# EAGLE design ms5839_with_trub (EAGLE 9.6.2)
COMPONENTS: MS5839 & Trübungsmessung; DESCRIPTION: Sensormodul; DRAWING_VERSION: 1.0; DRAWN: Tobias Poppe; FIRMA: Tobias Poppe; PRINTDATE: 30.01.2023; PROJECT: Open-WaLeS; STATUS: Prod.
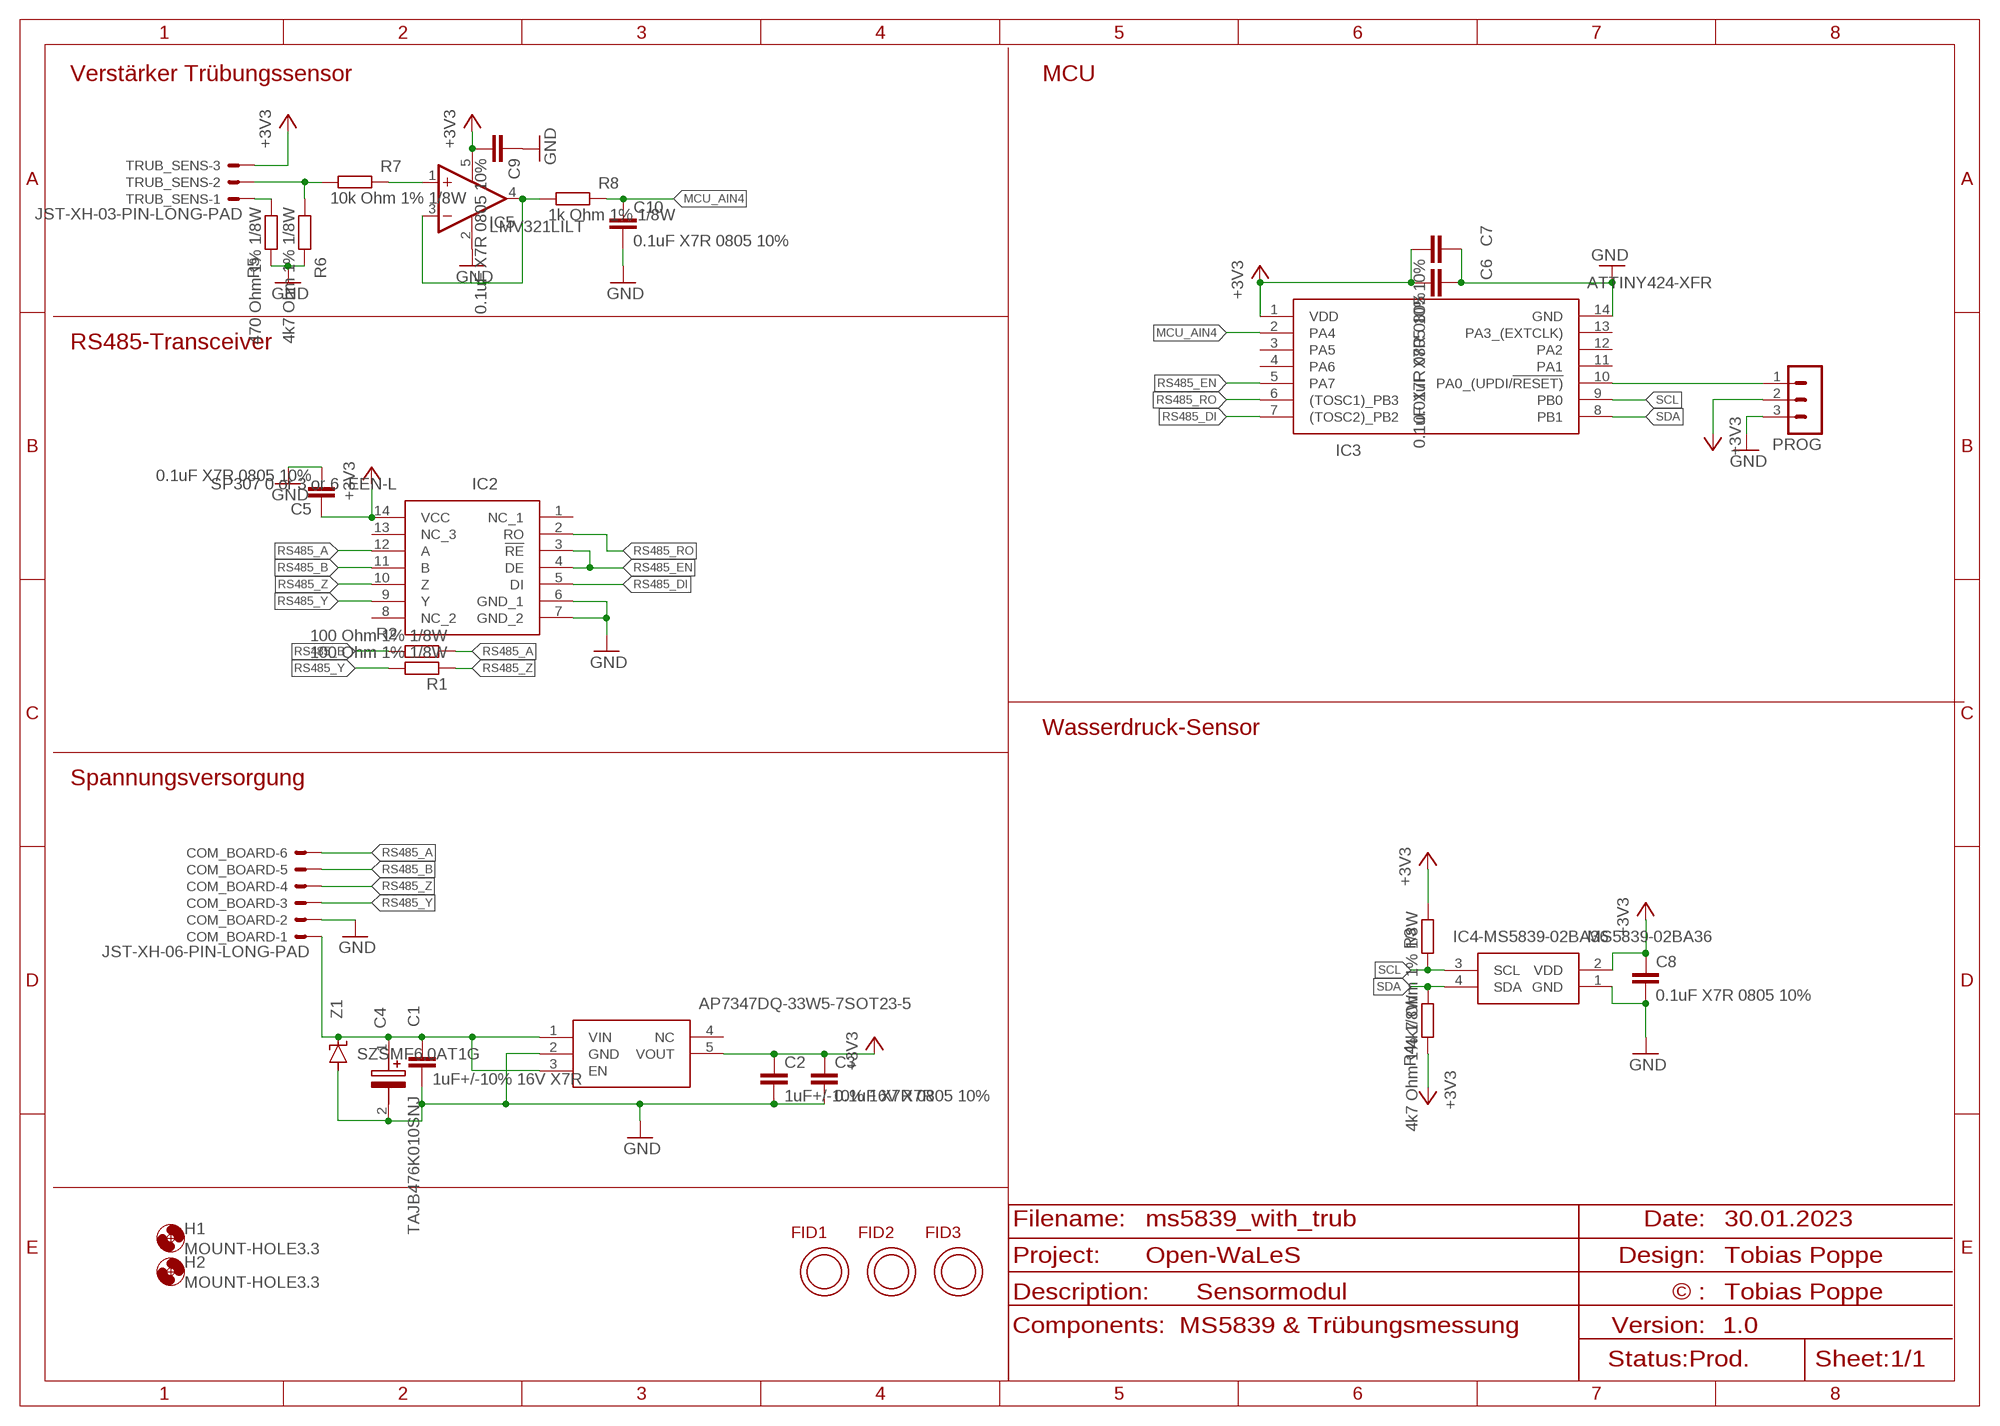
[diagram p0: schematic, sheet 1]

## Parts
C1  1uF+/-10% 16V X7R  C-EUC0805  [C0805]
C2  1uF+/-10% 16V X7R  C-EUC0805  [C0805]
C3  0.1uF X7R 0805 10%  C-EUC0805  [C0805]
C4  TAJB476K010SNJ  [CAPPM3528X210N]
C5  0.1uF X7R 0805 10%  C-EUC0805  [C0805]
C6  0.1uF X7R 0805 10%  C-EUC0805  [C0805]
C7  0.01uF X7R 0805 10%  C-EUC0805  [C0805]
C8  0.1uF X7R 0805 10%  C-EUC0805  [C0805]
C9  0.1uF X7R 0805 10%  C-EUC0805  [C0805]
C10  0.1uF X7R 0805 10%  C-EUC0805  [C0805]
COM_BOARD  JST-XH-06-PIN-LONG-PAD  [JST-XH-06-PACKAGE-LONG-PAD]
FID1  OPEN-PNP-FIDUCIAL  [OPEN-PNP-FIDUCIAL]
FID2  OPEN-PNP-FIDUCIAL  [OPEN-PNP-FIDUCIAL]
FID3  OPEN-PNP-FIDUCIAL  [OPEN-PNP-FIDUCIAL]
H1  MOUNT-HOLE3.3  [3,3]
H2  MOUNT-HOLE3.3  [3,3]
IC1  AP7347DQ-33W5-7SOT23-5  [SOT95P240X110-5N]
IC2  SP307 0 or 3 or 6 EEN-L  SP3076EEN-L  [SOIC127P600X175-14N]
IC3  ATTINY424-XFR  [SOP65P640X120-14N]
IC4-MS5839-02BA36  MS5839-02BA36  [MS583902BA36]
IC5  LMV321LILT  LMV321M5X  [SOT23-5]
PROG  MA03-1  [MA03-1]
R1  100 Ohm 1% 1/8W  R-EU_R0805  [R0805]
R2  100 Ohm 1% 1/8W  R-EU_R0805  [R0805]
R3  4k7 Ohm 1% 1/8W  R-EU_R0805  [R0805]
R4  4k7 Ohm 1% 1/8W  R-EU_R0805  [R0805]
R5  470 Ohm 1% 1/8W  R-EU_R0805  [R0805]
R6  4k7 Ohm 1% 1/8W  R-EU_R0805  [R0805]
R7  10k Ohm 1% 1/8W  R-EU_R0805  [R0805]
R8  1k Ohm 1% 1/8W  R-EU_R0805  [R0805]
TRUB_SENS  JST-XH-03-PIN-LONG-PAD  [JST-XH-03-PACKAGE-LONG-PAD]
Z1  SZSMF6.0AT1G  SZSMF_XX  [SOD123]

## Nets
+3V3: C2.1 C3.1 C5.1 C6.2 C7.2 C8.1 C9.2 IC1.5(VOUT) IC2.14(VCC) IC3.1(VDD) IC4-MS5839-02BA36.2(VDD) IC5.5(V+) PROG.2 R3.1 R4.2 TRUB_SENS.3
GND: C1.2 C2.2 C3.2 C4.2(-) C5.2 C6.1 C7.1 C8.2 C9.1 C10.2 COM_BOARD.2 IC1.2(GND) IC2.6(GND_1) IC2.7(GND_2) IC3.14(GND) IC4-MS5839-02BA36.1(GND) IC5.2(V-) PROG.3 R5.2 R6.2 Z1.A
MCU_AIN4: C10.1 IC3.2(PA4) R8.2
N$1: C1.1 C4.1(+) COM_BOARD.1 IC1.1(VIN) IC1.3(EN) Z1.C
N$2: IC3.10(PA0_(UPDI/!RESET)) PROG.1
N$3: R5.1 TRUB_SENS.1
N$4: R6.1 R7.1 TRUB_SENS.2
N$5: IC5.1(+IN) R7.2
N$6: IC5.3(-IN) IC5.4(OUT) R8.1
RS485_A: COM_BOARD.6 IC2.12(A) R2.1
RS485_B: COM_BOARD.5 IC2.11(B) R2.2
RS485_DI: IC2.5(DI) IC3.7((TOSC2)_PB2)
RS485_EN: IC2.3(!RE) IC2.4(DE) IC3.5(PA7)
RS485_RO: IC2.2(RO) IC3.6((TOSC1)_PB3)
RS485_Y: COM_BOARD.3 IC2.9(Y) R1.2
RS485_Z: COM_BOARD.4 IC2.10(Z) R1.1
SCL: IC3.9(PB0) IC4-MS5839-02BA36.3(SCL) R3.2
SDA: IC3.8(PB1) IC4-MS5839-02BA36.4(SDA) R4.1
Unconnected: IC1.4(NC) IC2.1(NC_1) IC2.8(NC_2) IC2.13(NC_3) IC3.3(PA5) IC3.4(PA6) IC3.11(PA1) IC3.12(PA2) IC3.13(PA3_(EXTCLK))

## Notes on the sheet
- Verstärker Trübungssensor | MCU
- RS485-Transceiver
- Wasserdruck-Sensor
- Spannungsversorgung

## Library data of the parts
C1-C3 C5-C10 = rcl:C-EU: CAPACITOR, European symbol; SPICEPREFIX: C
C4 = samacsys:TAJB476K010SNJ: Tantalum Capacitors - Solid SMD 10volts 47uF 10% Source: Datasheet <http://datasheets.avx.com/TAJ.pdf>; ARROW_PART_NUMBER: TAJB476K010SNJ; ARROW_PRICE-STOCK: https://www.arrow.com/en/products/tajb476k010snj/avx; DESCRIPTION: Tantalum Capacitors - Solid SMD 10volts 47uF 10%; HEIGHT: 2.1mm; MANUFACTURER_NAME: AVX; MANUFACTURER_PART_NUMBER: TAJB476K010SNJ; MOUSER_PART_NUMBER: 581-TAJB476K010SNJ; MOUSER_PRICE-STOCK: https://www.mouser.co.uk/ProductDetail/AVX/TAJB476K010SNJ?qs=ZkOCJBwOl244F5j46leeNA%3D%3D
COM_BOARD = Rembrandt Electronics - JST XH Connectors v1-0:JST-XH-06-PIN: JST XH Connector 2 Pin Wire to board connector. Pitch: 2,54 mm, (0.100") Number of pins: 6 Created by Rembrandt Electronics www.rembrandtelectronics.com
FID1-FID3 = topo-eng:OPEN-PNP-FIDUCIAL
H1 H2 = holes:MOUNT-HOLE: MOUNTING HOLE with drill center marker
IC1 = samacsys:AP7347DQ-33W5-7: LDO Voltage Regulators LDO CMOS LowCurr SOT25 T&R 3K Source: Datasheet <https://ad.componentsearchengine.com/partRequest.html?fs=0&partNumber=AP7347DQ-33W5-7&partID=15420390&lang=null&packageCategoryID=54&C=1&W=1>
IC2 = samacsys:SP3076EEN-L: RS-422/RS-485 Interface IC RS485/RS422 Driver/ Receiver Transceiver Source: Datasheet <https://www.exar.com/content/document.ashx?id=1399>; DESCRIPTION: RS-422/RS-485 Interface IC RS485/RS422 Driver/ Receiver Transceiver; HEIGHT: 1.75mm; MANUFACTURER_NAME: MaxLinear, Inc.; MANUFACTURER_PART_NUMBER: SP3076EEN-L; MOUSER_PART_NUMBER: 701-SP3076EEN-L; MOUSER_PRICE-STOCK: https://www.mouser.co.uk/ProductDetail/MaxLinear/SP3076EEN-L?qs=H%252BP%2FcHWii3dfBcWqKh1L5g%3D%3D
IC3 = samacsys:ATTINY424-XFR: 8-bit Microcontrollers - MCU 20MHz, 4KB, TSSOP14, Ind 125C, Green, T&R Source: Datasheet <https://eu.mouser.com/datasheet/2/268/ATtiny1624_26_27_DataSheet_DS40002234A-1984012.pdf>; DESCRIPTION: 8-bit Microcontrollers - MCU 20MHz, 4KB, TSSOP14, Ind 125C, Green, T&R; HEIGHT: 1.2mm; MANUFACTURER_NAME: Microchip; MANUFACTURER_PART_NUMBER: ATTINY424-XFR; MOUSER_PART_NUMBER: 579-ATTINY424-XFR; MOUSER_PRICE-STOCK: https://www.mouser.co.uk/ProductDetail/Microchip-Technology/ATTINY424-XFR?qs=pUKx8fyJudDOEG3jn4DZaw%3D%3D
IC4-MS5839-02BA36 = samacsys:MS5839-02BA36: Board Mount Pressure Sensors MS5839-02BA36 CL RESISTANT LS T&R SEN Source: Datasheet <https://www.te.com/commerce/DocumentDelivery/DDEController?Action=srchrtrv&DocNm=MS5839-02BA&DocType=DS&DocLang=English>; DESCRIPTION: Board Mount Pressure Sensors MS5839-02BA36 CL RESISTANT LS T&R SEN; HEIGHT: 2.65mm; MANUFACTURER_NAME: TE Connectivity; MANUFACTURER_PART_NUMBER: MS5839-02BA36; MOUSER_PART_NUMBER: 824-MS5839-02BA36; MOUSER_PRICE-STOCK: https://www.mouser.co.uk/ProductDetail/Measurement-Specialties/MS5839-02BA36?qs=xZ%2FP%252Ba9zWqZ%2FNhMNRu8tng%3D%3D
IC5 = linear:LMV321?*: General Purpose, Low Voltage, Rail-to-Rail Output Operational Amplifiers Source: http://www.national.com/mpf/LM/LMV321.html http://www.national.com/dt/lmv_qual.pdf
PROG = con-lstb:MA03-1: PIN HEADER; OC_FARNELL: unknown; OC_NEWARK: unknown
R1-R8 = rcl:R-EU_: RESISTOR, European symbol; SPICEPREFIX: R
TRUB_SENS = Rembrandt Electronics - JST XH Connectors v1-0:JST-XH-03-PIN: JST XH Connector 2 Pin Wire to board connector. Pitch: 2,54 mm, (0.100") Number of pins: 3 Created by Rembrandt Electronics www.rembrandtelectronics.com
Z1 = topo-eng:SZSMF_XX

## Board
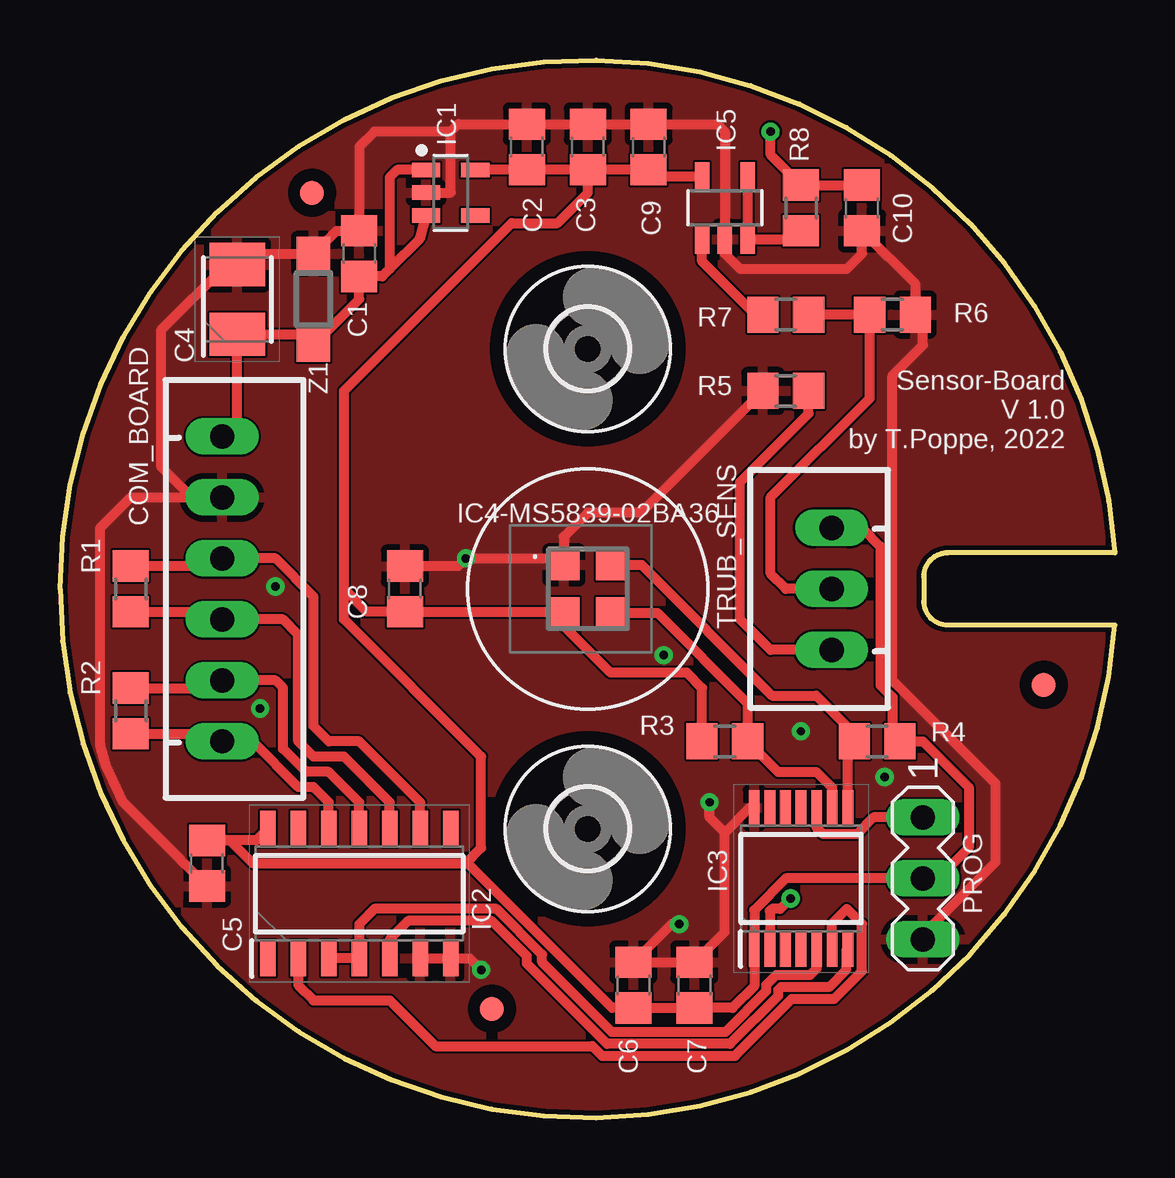
[diagram p1: board, top side]
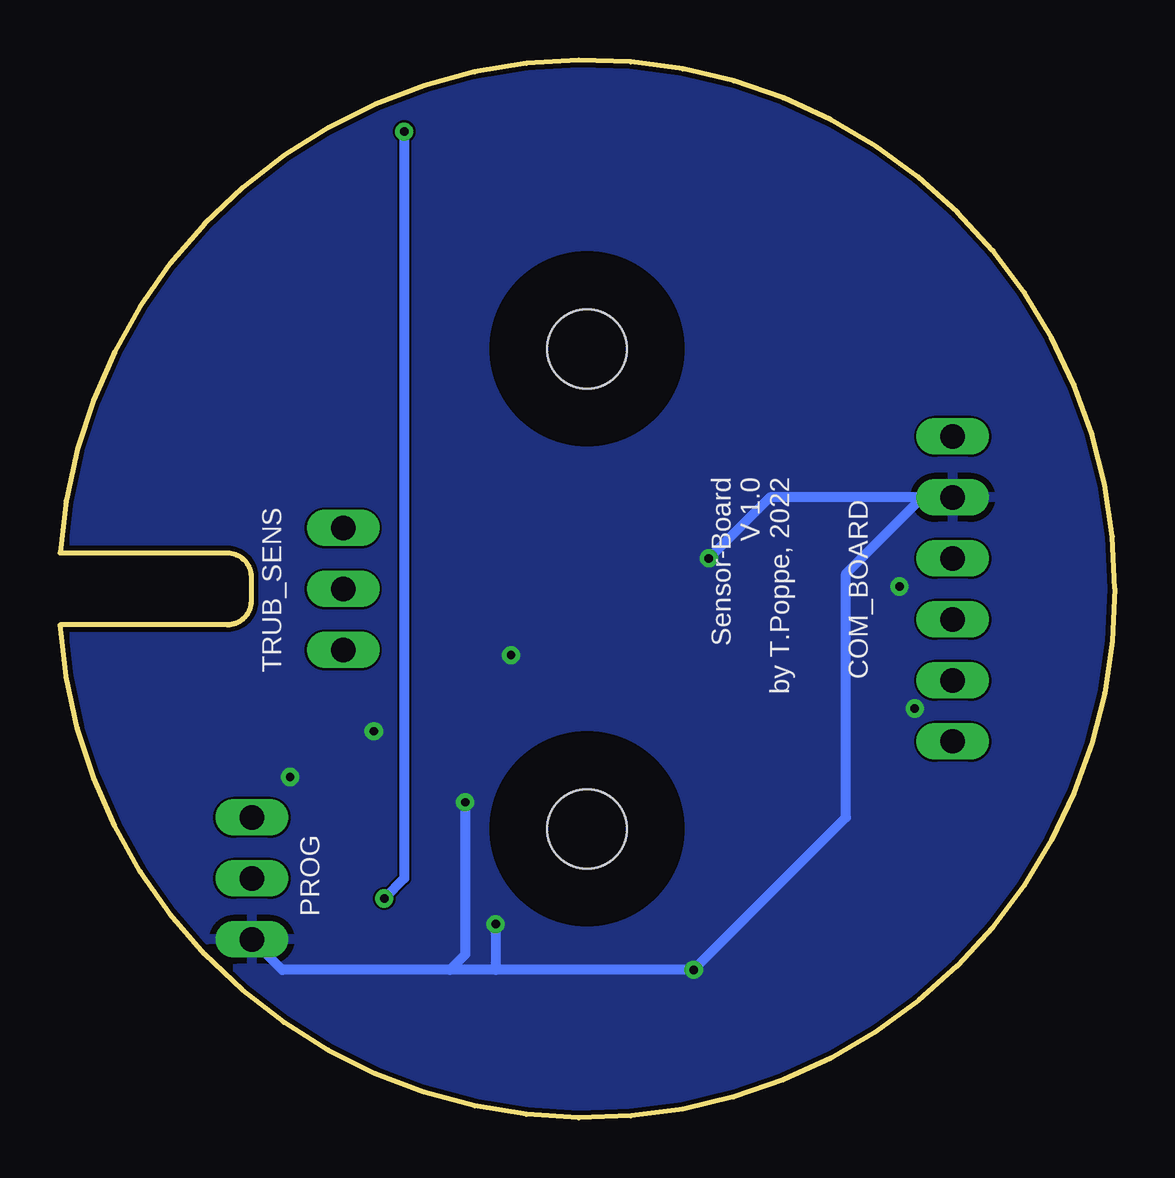
[diagram p2: board, bottom side, seen from below]

Size 43.97 x 44.07 mm. Coordinates in mm from the lower left corner, seen from the top.
Outline: 43.97,23.54 37,23.54 arc90 36,22.54 36,21.54 arc90 37,20.54 43.97,20.54 arc-176 0,22.04 arc-176 43.97,23.54
Copper layers (1*16): Top 0.035mm / dielectric 1.065mm / Bottom 0.035mm
Design rules "jlcpcb_4_layer *": minimum track width 3.5mil, minimum drill 0.2mm, track to track 3.5mil, track to pad 6mil, pad to pad 6mil, via to via 6mil, smd to smd 6mil, copper to edge 0.2mm, drill to drill 6mil, minimum pad ring 10mil, minimum via ring 8mil, stop-mask expansion 4mil, vias tented up to drill 0mil, thermal gap 10mil

### Footprints (pad centres in the part's own frame; a part is rotated, then mirrored left to right if it is on the bottom)
C0805 = smd 1.3 x 1.5: 1 -0.95,0; 2 0.95,0
CAPPM3528X210N = smd 1.8 x 2.3: 1 -1.45,0; 2 1.45,0
JST-XH-06-PACKAGE-LONG-PAD = drill 1.016 long: 1 -6.35,0; 2 -3.81,0; 3 -1.27,0; 4 1.27,0; 5 3.81,0; 6 6.35,0
OPEN-PNP-FIDUCIAL = smd 1 x 1: FID$1 0,0
3,3 = hole 3.3: 0,0
SOT95P240X110-5N = smd 1.18 x 0.609: 1 -1.024,0.95; 2 -1.024,0; 3 -1.024,-0.95; 4 1.024,-0.95; 5 1.024,0.95
SOIC127P600X175-14N = smd 1.5 x 0.65: 1 -2.7,3.81; 2 -2.7,2.54; 3 -2.7,1.27; 4 -2.7,0; 5 -2.7,-1.27; 6 -2.7,-2.54; 7 -2.7,-3.81; 8 2.7,-3.81; 9 2.7,-2.54; 10 2.7,-1.27; 11 2.7,0; 12 2.7,1.27; 13 2.7,2.54; 14 2.7,3.81
SOP65P640X120-14N = smd 1.475 x 0.45: 1 -2.938,1.95; 2 -2.938,1.3; 3 -2.938,0.65; 4 -2.938,0; 5 -2.938,-0.65; 6 -2.938,-1.3; 7 -2.938,-1.95; 8 2.938,-1.95; 9 2.938,-1.3; 10 2.938,-0.65; 11 2.938,0; 12 2.938,0.65; 13 2.938,1.3; 14 2.938,1.95
MS583902BA36 = smd 1.3 x 1.3: 1 1,-1; 2 1,1; 3 -1,1; 4 -1,-1
SOT23-5 = smd 0.6 x 1.2: 1 -0.95,-1.306; 2 0,-1.306; 3 0.95,-1.306; 4 0.95,1.306; 5 -0.95,1.306
MA03-1 = drill 1.016 long: 1 -2.54,0; 2 0,0; 3 2.54,0
R0805 = smd 1.3 x 1.5: 1 -0.95,0; 2 0.95,0
JST-XH-03-PACKAGE-LONG-PAD = drill 1.016 long: 1 -2.54,0; 2 0,0; 3 2.54,0
SOD123 = smd 1.4 x 1.4: A 1.9,0; C -1.9,0

### Placement (x,y rotation side)
C1  12.47,36.01 90 top
C2  19.46,40.45 90 top
C3  22,40.45 90 top
C4  7.39,34.1 90 top
C5  6.12,10.61 270 top
C6  23.91,5.53 270 top
C7  26.45,5.53 270 top
C8  14.38,22.04 90 top
C9  24.54,40.45 270 top
C10  33.43,37.91 270 top
COM_BOARD  6.76,22.04 270 top
FID1  18,4.54 0 top
FID2  41,18.04 0 top
FID3  10.5,38.54 0 top
H1  22,32.04 0 top
H2  22,12.04 0 top
IC1  16.29,38.55 0 top
IC2  12.47,9.34 90 top
IC3  30.89,9.97 90 top
IC4-MS5839-02BA36  22,22.04 180 top
IC5  27.71,37.91 0 top
PROG  35.97,9.97 270 top
R1  2.95,22.04 90 top
R2  2.95,16.96 90 top
R3  27.71,15.69 0 top
R4  34.06,15.69 0 top
R5  30.25,30.29 180 top
R6  34.7,33.47 0 top
R7  30.25,33.47 180 top
R8  30.89,37.91 90 top
TRUB_SENS  32.16,22.04 90 top
Z1  10.57,34.1 90 top

### Tracks (layer width: path | path; a pad name or v marks a point on that pad's centre or on a via)
+3V3
  Top 0.406: IC5.5 24.82,39.22 C9.2 C3.1 | C3.1 C2.1 17.59,39.5 IC1.5 | 20.95,21.09 C8.1 12.79,21.09 11.84,22.04 | 20.95,21.09 IC4-MS5839-02BA36.2 | 11.84,22.04 11.84,30.29 18.82,37.28 20.73,37.28 22,38.55 C3.1 | IC2.14 8.19,11.56 C5.1 7.08,11.56 8.03,10.61 16.92,10.61 | 16.92,10.61 17.55,11.24 17.55,15.05 11.84,20.77 11.84,22.04 | 16.92,10.61 16.98,10.61 23.02,4.58 C6.2 C7.2 28.04,4.58 28.94,5.48 IC3.1 28.94,8.66 30.25,9.97 PROG.2 36.6,9.97 37.88,11.24 37.88,13.78 35.97,15.69 R4.2 34.7,16 34.7,17.53 34.2,18.02 34.2,23.8 33.43,24.58 TRUB_SENS.3 | R3.1 26.77,17.91 26.13,18.55 22.95,18.55 20.95,20.55 20.95,21.09
GND  (via drill 0.35)
  Top 0.406: C8.2 16.6,22.99 v16.92,23.31 20.73,23.31 IC4-MS5839-02BA36.1 21,24.21 22,25.21 24.23,25.21 R5.2 | IC1.2 16.29,38.55 16.29,41.09 | 16.29,41.09 13.11,41.09 12.47,40.45 C1.2 11.53,36.96 Z1.A 7.84,36 C4.2 6.94,35.55 4.22,32.83 4.22,27.12 5.49,25.85 COM_BOARD.2 2.95,25.85 1.68,24.58 1.68,15.53 1.9,14.72 2.63,13.16 5.02,10.76 5.23,10.55 C5.2 | 16.29,41.09 16.6,41.4 C2.2 C3.2 C9.1 27.4,41.4 27.71,41.09 IC5.2 27.71,36.01 28.35,35.37 32.8,35.37 33.43,36.01 C10.2 35.65,34.74 R6.2 35.97,33.15 35.97,32.2 34.7,30.93 34.7,18.23 39.01,13.92 39.01,10.67 35.97,7.63 PROG.3 | 27.71,11.88 27.71,7.75 C7.1 C6.1 25.5,8.07 v25.81,8.07 | 27.71,11.88 28.75,12.91 IC3.14 | IC2.6 IC2.7 17.08,6.64 v17.55,6.16 | 27.71,11.88 27.08,12.51 v27.08,13.15
  Bottom 0.406: v16.92,23.31 14.38,25.85 COM_BOARD.2 8.03,25.85 11.21,22.67 11.21,12.51 v17.55,6.16 25.81,6.16 | 25.81,6.16 27.71,6.16 | 27.71,6.16 34.7,6.16 PROG.3 | v27.08,13.15 27.08,6.8 27.71,6.16 | v25.81,8.07 25.81,6.16
  other vias: 8.98,22.14 8.34,17.06 30.88,16.1 34.38,14.2 25.17,19.28
  pour Top: 44,0.04 44,44.04 0,44.04 0,0.04
  pour Bottom: 44,44.04 44,0.04 0,0.04 0,44.04
MCU_AIN4  (via drill 0.35)
  Top 0.406: C10.1 R8.2 29.62,40.13 v29.62,41.09 | v30.46,9.14 30.02,8.7 29.68,8.7 29.59,8.61 IC3.2
  Bottom 0.406: v29.62,41.09 29.62,9.97 v30.46,9.14
N$1
  Top 0.406: IC1.3 14.98,36.61 13.74,35.37 | 13.74,35.37 13.43,35.06 C1.1 12.47,34.11 Z1.C 10.12,32.65 C4.1 7.39,29.02 COM_BOARD.1 | IC1.1 14.06,39.5 13.74,39.18 13.74,35.37
N$2
  Top 0.406: PROG.1 33.91,12.51 33.21,11.82 31.82,11.82 31.54,12.1 IC3.10
N$3
  Top 0.406: TRUB_SENS.1 29.62,19.5 28.35,20.77 28.35,26.48 31.2,29.34 R5.1
N$4
  Top 0.406: TRUB_SENS.2 30.25,22.04 29.62,22.67 29.62,25.85 33.75,29.98 R6.1 R7.1
N$5
  Top 0.406: R7.2 28.98,33.47 26.77,35.69 IC5.1
N$6
  Top 0.406: R8.1 30.53,36.61 IC5.3 IC5.4
RS485_A
  Top 0.406: R2.1 6.44,16.01 COM_BOARD.6 8.03,15.69 9.94,13.78 10.57,13.78 11.21,13.15 IC2.12
RS485_B
  Top 0.406: R2.2 6.44,17.91 COM_BOARD.5 8.98,18.23 9.3,17.91 9.3,15.37 10.25,14.42 11.21,14.42 12.47,13.15 IC2.11
RS485_DI
  Top 0.406: IC3.7 32.77,6.97 32.77,6.15 32.07,5.45 30.05,5.45 29.93,5.32 29.93,5.07 27.93,3.08 22.8,3.08 19.46,6.42 19.46,6.73 17.98,8.21 14.52,8.21 13.74,7.43 IC2.5
RS485_EN
  Top 0.406: IC2.3 IC2.4 12.47,8.07 13.11,8.7 18.19,8.7 20.09,6.8 20.09,6.48 23.01,3.57 27.73,3.57 29.43,5.28 29.43,5.53 29.85,5.94 31.26,5.94 31.54,6.22 IC3.5
RS485_RO
  Top 0.406: IC2.2 9.94,5.53 10.57,4.89 13.74,4.89 15.65,2.99 22.19,2.99 22.6,2.58 28.14,2.58 30.51,4.95 32.27,4.95 33.43,6.11 33.43,8.07 32.8,8.7 32.16,8.07 32.16,7.06 IC3.6
RS485_Y
  Top 0.406: R1.2 6.44,22.99 COM_BOARD.3 8.98,23.31 10.57,21.72 10.57,16.32 11.21,15.69 12.47,15.69 15.02,13.15 IC2.9
RS485_Z
  Top 0.406: R1.1 6.44,21.09 COM_BOARD.4 9.3,20.77 9.94,20.13 9.94,15.69 10.57,15.05 11.84,15.05 13.74,13.15 IC2.10
SCL
  Top 0.406: IC3.9 32.19,13.75 31.52,14.42 29.93,14.42 R3.2 28.66,17.28 24.91,21.04 IC4-MS5839-02BA36.3
SDA
  Top 0.406: IC3.8 32.84,15.41 R4.1 33.12,16 31.52,17.59 29.68,17.59 24.24,23.04 IC4-MS5839-02BA36.4

### Text on the board
tNames: Sensor-Board / V 1.0 / by T.Poppe, 2022
bNames: Sensor-Board / V 1.0 / by T.Poppe, 2022 | COM_BOARD | TRUB_SENS | PROG